# EAGLE design Comparator (EAGLE 7.4.0)
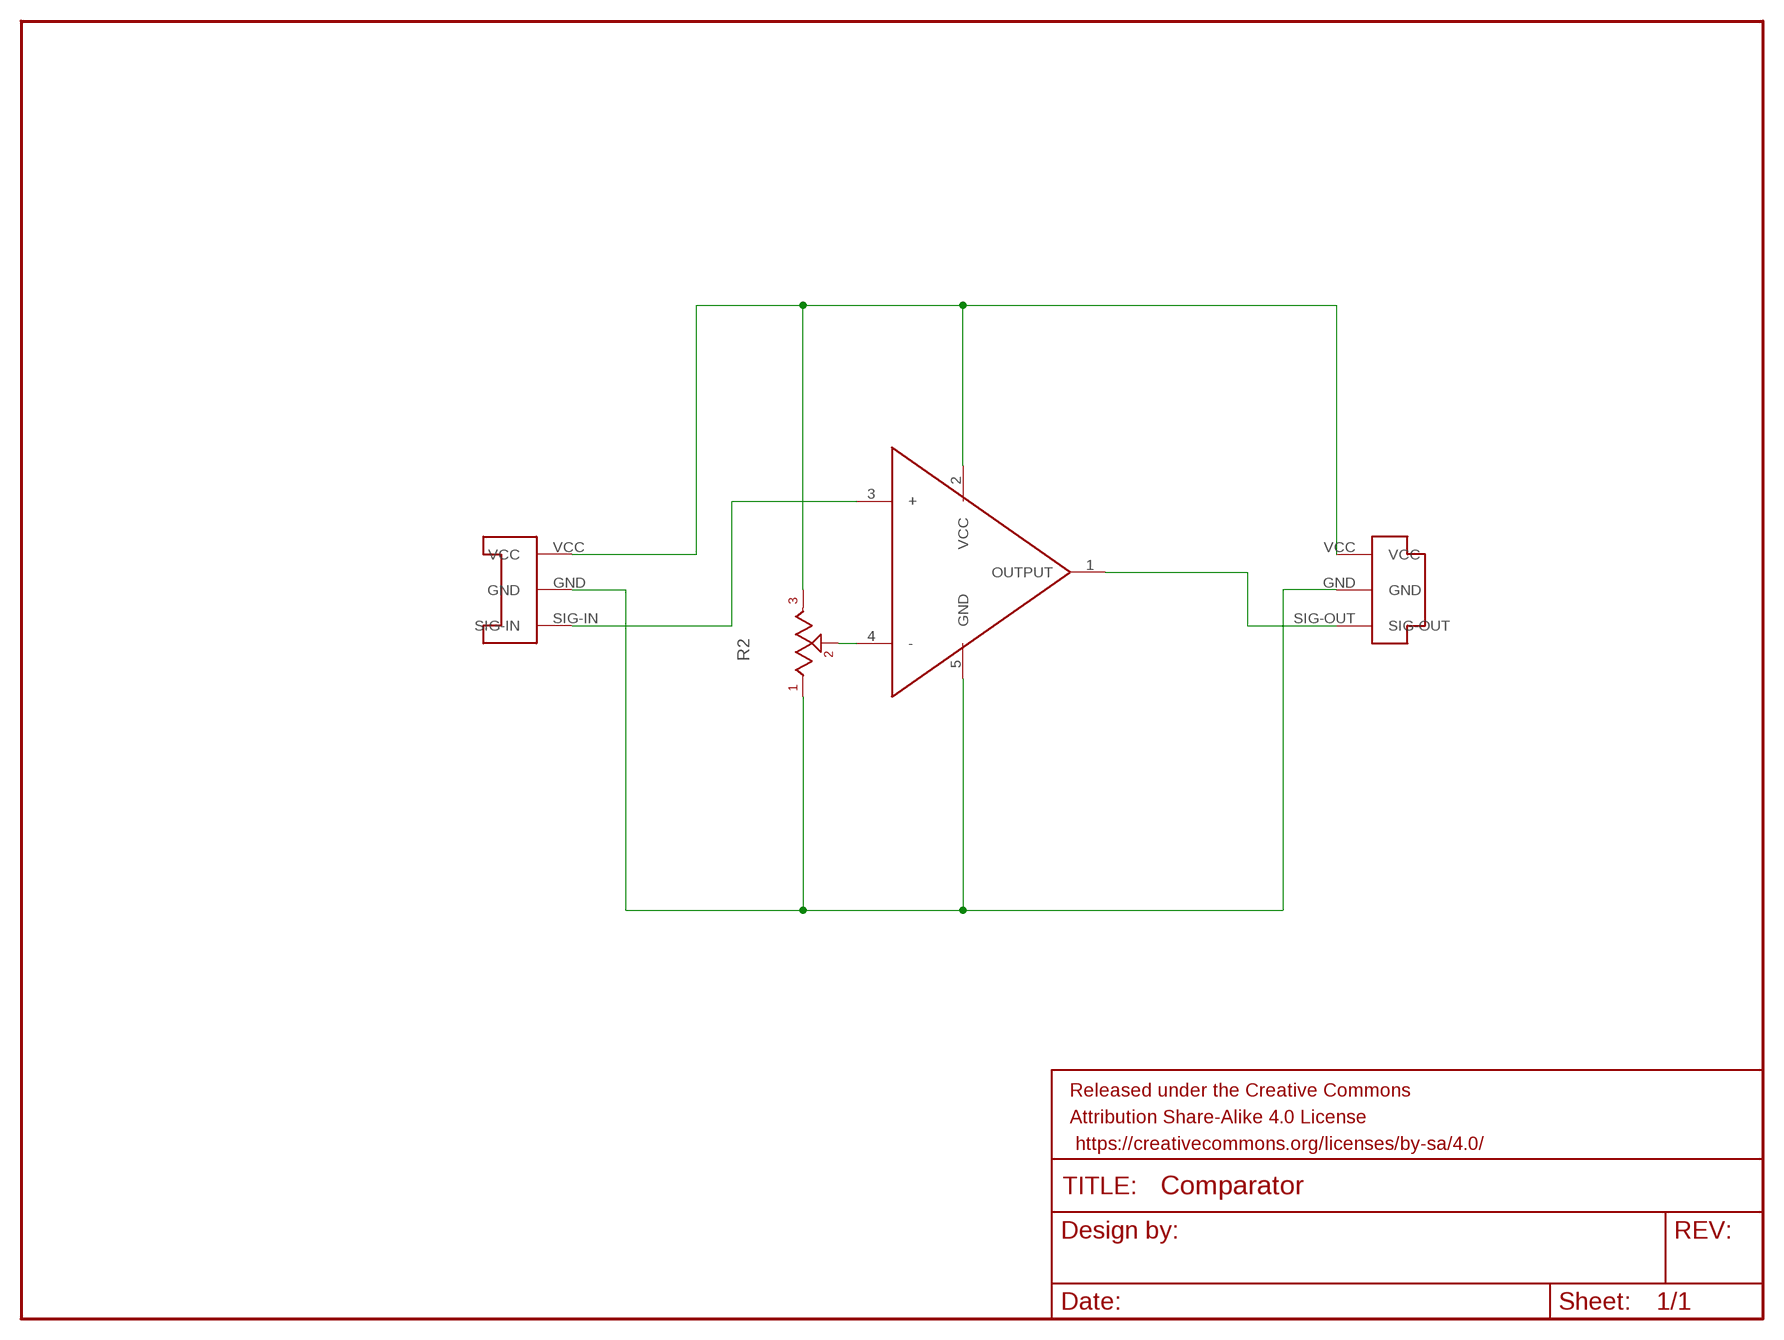
[diagram p0: schematic, sheet 1]

## Parts
FRAME1  FRAME-LETTERNO_PACKAGE  [DUMMY]
R2  POT-TRIM-SMD-BOURNS-3314J-1  [POT-TRIM-SMD-BOURNS-3314]
U$1  CONN-PLUG-3POS-3MM  [PLUG-3POS-3MM-SMD]
U$2  CONN-SOCKET-3POS-3MM  [SOCKET-3POS-3MM-SMD]
U$3  COMPARATOR-NCS2200  [SOT23-5]

## Nets
GND: R2.3 U$1.GND U$2.GND U$3.5(GND)
N$2: U$2.SIG-IN U$3.3(+)
N$5: R2.2 U$3.4(-)
N$6: U$1.SIG-OUT U$3.1(OUTPUT)
VCC: R2.1 U$1.VCC U$2.VCC U$3.2(VCC)

## Library data of the parts
FRAME1 = SparkFun-Aesthetics:FRAME-LETTER: Schematic Frame Standard 8.5x11 US Letter frame; DESIGNER: Nobody; VERSION: v01
R2 = LITTLEBITS140915:POT-TRIM-SMD-BOURNS-3314: Bourns 3314 - 4mm Square Trimming Potentiometer
U$1 = EmbeddedPlayground:CONN-PLUG-3POS-3MM: Surface mount board to board connector. Female socket, 3 position.
U$2 = EmbeddedPlayground:CONN-SOCKET-3POS-3MM: Surface mount board to board connector. Female socket, 3 position.
U$3 = EmbeddedPlayground:COMPARATOR-NCS2200

## Board
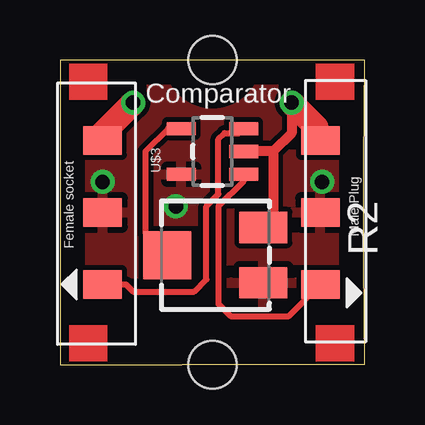
[diagram p1: board, top side]
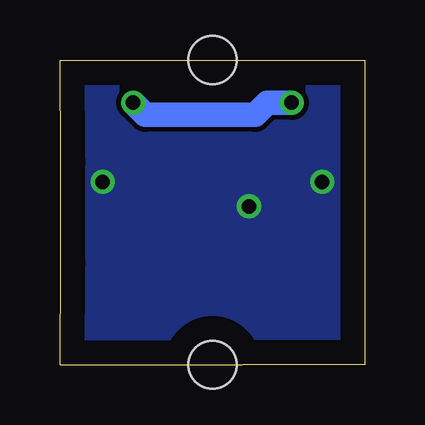
[diagram p2: board, bottom side, seen from below]

Size 12.7 x 12.7 mm. Coordinates in mm from the lower left corner, seen from the top.
Outline: 5.08,0 0,0 0,12.7 5.08,12.7
Outline: 5.1,12.7 12.7,12.7 arc2 12.7,0 5.1,0
Copper layers (1*16): Top 0.035mm / dielectric 1.5mm / Bottom 0.035mm
Design rules "default": minimum track width 10mil, minimum drill 24mil, track to track 8mil, track to pad 8mil, pad to pad 8mil, via to via 8mil, smd to smd 8mil, copper to edge 40mil, drill to drill 8mil, minimum pad ring 10mil, minimum via ring 8mil, stop-mask expansion 4mil, vias tented up to drill 0mil, thermal gap 10mil
Holes 2 mm at 6.35,12.7 6.35,0

### Footprints (pad centres in the part's own frame; a part is rotated, then mirrored left to right if it is on the bottom)
POT-TRIM-SMD-BOURNS-3314 = smd 1.3 x 2: 1 -1.15,2; 3 1.15,2 | smd 2 x 2: 2 0,-2
PLUG-3POS-3MM-SMD = smd 1.2 x 1.6: GND 0,0; SIG-OUT 3,0; VCC -3,0
SOCKET-3POS-3MM-SMD = smd 1.2 x 1.6: GND 0,0; SIG-IN -3,0; VCC 3,0
SOT23-5 = smd 0.55 x 1.2: 1 -0.95,-1.3; 2 0,-1.3; 3 0.95,-1.3; 4 0.95,1.3; 5 -0.95,1.3

### Placement (x,y rotation side)
FRAME1  0,0 0 top
R2  6.48,4.57 270 top
U$1  10.85,6.35 270 top
U$2  1.78,6.35 90 top
U$3  6.35,8.89 90 top

### Tracks (layer width: path | path; a pad name or v marks a point on that pad's centre or on a via)
GND  (via drill 0.6)
  other vias: 1.78,7.62 4.83,6.6 10.92,7.62
  pour Top: -2.54,15.24 -2.54,-2.54 15.24,-2.54 15.24,15.24
  pour Bottom: -2.54,15.24 15.24,15.24 15.24,-2.54 -2.54,-2.54
N$2
  Top 0.254: U$2.SIG-IN 2.75,3.35 3.05,3.05 5.59,3.05 6.1,3.56 6.1,6.6 6.6,7.11 6.6,9.4 6.86,9.65 7.46,9.65 U$3.3
N$4  (via drill 0.6)
  other vias: 3.05,10.92
N$5
  Top 0.254: U$3.4 4.51,9.84 3.56,8.89 3.56,5.49 R2.2
N$6
  Top 0.254: U$3.1 7.65,7.65 6.6,6.6 6.6,2.54 7.11,2.03 9.53,2.03 U$1.SIG-OUT
N$7  (via drill 0.6)
  other vias: 9.65,10.92
VCC  (via drill 0.5)
  Top 0.406: v9.65,10.92 9.65,9.65 8.89,8.89 | 8.89,8.89 U$3.2 | 8.89,8.89 8.89,6.13 R2.1
  Top 1.016: U$2.VCC 1.78,9.65 v3.05,10.92 | v9.65,10.92 10.67,9.91 10.67,9.53 U$1.VCC
  Bottom 1.016: v3.05,10.92 4.06,10.92 4.57,10.41 9.14,10.41 v9.65,10.92

### Text on the board
tPlace: Comparator